# EAGLE schematic main (EAGLE 9.4.2)
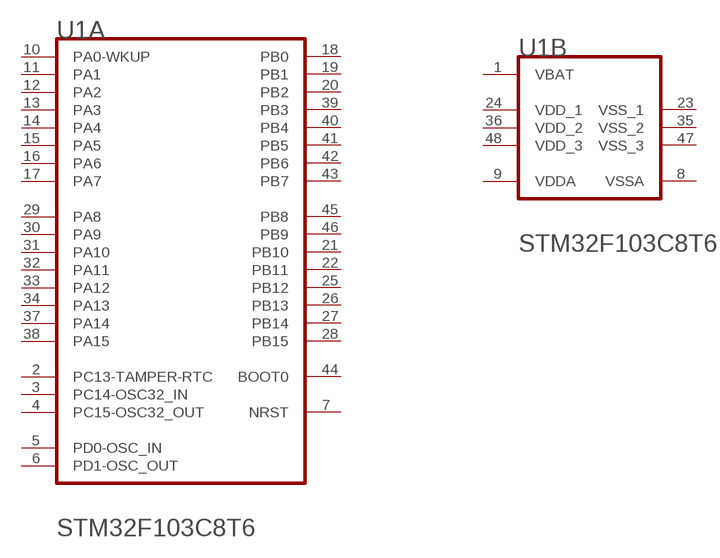
[diagram p0: schematic, sheet 1]

## Parts
U1  STMICROELECTRONICS_STM32F103C8T6STMICROELECTRONICS_STM32F103C8T6_0_1  [STMICROELECTRONICS_STM32F103C8T6_1]
Unconnected: U1.2(A:PC13-TAMPER-RTC) U1.3(A:PC14-OSC32_IN) U1.4(A:PC15-OSC32_OUT) U1.5(A:PD0-OSC_IN) U1.6(A:PD1-OSC_OUT) U1.7(A:NRST) U1.10(A:PA0-WKUP) U1.11(A:PA1) U1.12(A:PA2) U1.13(A:PA3) U1.14(A:PA4) U1.15(A:PA5) U1.16(A:PA6) U1.17(A:PA7) U1.18(A:PB0) U1.19(A:PB1) U1.20(A:PB2) U1.21(A:PB10) U1.22(A:PB11) U1.25(A:PB12) U1.26(A:PB13) U1.27(A:PB14) U1.28(A:PB15) U1.29(A:PA8) U1.30(A:PA9) U1.31(A:PA10) U1.32(A:PA11) U1.33(A:PA12) U1.34(A:PA13) U1.37(A:PA14) U1.38(A:PA15) U1.39(A:PB3) U1.40(A:PB4) U1.41(A:PB5) U1.42(A:PB6) U1.43(A:PB7) U1.44(A:BOOT0) U1.45(A:PB8) U1.46(A:PB9)

## Power pins joined to a net without a drawn wire
VBAT: U1.1(B:VBAT)
VDD_1: U1.24(B:VDD_1)
VDD_2: U1.36(B:VDD_2)
VDD_3: U1.48(B:VDD_3)
VDDA: U1.9(B:VDDA)
VSS_1: U1.23(B:VSS_1)
VSS_2: U1.35(B:VSS_2)
VSS_3: U1.47(B:VSS_3)
VSSA: U1.8(B:VSSA)

## Library data of the parts
U1 = STMicroelectronics - STM32F103C8T6:STMICROELECTRONICS_STM32F103C8T6: MC-ARM-STM32F103X8_B-SQ48; AD_CONVERTER: 2x12-bit (10 Channel); CIIVA_IDS: 2386704; COMPONENT_LINK_1_DESCRIPTION: Manufacturer URL; COMPONENT_LINK_1_URL: http://www.st.com/web/en/home.html; COMPONENT_LINK_3_DESCRIPTION: Package Specification; COMPONENT_LINK_3_URL: http://www.st.com/st-web-ui/static/active/en/resource/technical/document/datasheet/DM00058181.pdf; CORE: ARM Cortex-M3; DATASHEET: http://www.st.com/st-web-ui/static/active/en/resource/technical/document/datasheet/CD00161566.pdf; DATASHEET_VERSION: Rev. 16; FLASH_SIZE_PROG_KB: 64; FOOTPRINT_VARIANT_NAME_0: Level C; FOOTPRINT_VARIANT_NAME_1: Level B; FOOTPRINT_VARIANT_NAME_2: Level A; IMPORTED: yes; IMPORTED_FROM: vault; IMPORT_TS: 1521868154; INTERNAL_RAM_SIZE_KB: 20; IOS_HIGH_CURRENT: 37; MF: STMicroelectronics; MOUNTING_TECHNOLOGY: Surface Mount; MPN: STM32F103C8T6; OPERATING_FREQUENCYF_PROCESSOR_SPEED_MHZ: 72; PACKAGE: LQFP48; PACKAGE_DESCRIPTION: 48-Pin Low Profile Quad Flat Package, 7 x 7 mm Body, 0.5 mm Pitch; PACKAGE_VERSION: Rev. 6, 06/2013; PACKING: Tray; PREFIX: U; RELEASE_DATE: 1387182656; SUPPLY_VOLTAGEVCC_MIN_V: 2; VAULT_GUID: 5676E1B9-8AC9-43C7-8422-60B8A52E6342; VAULT_REVISION: 8701FB9E-FAC1-4E21-B559-DB18E20ECA41